# EAGLE schematic bene2stmbl-smd (EAGLE 7.2.0)
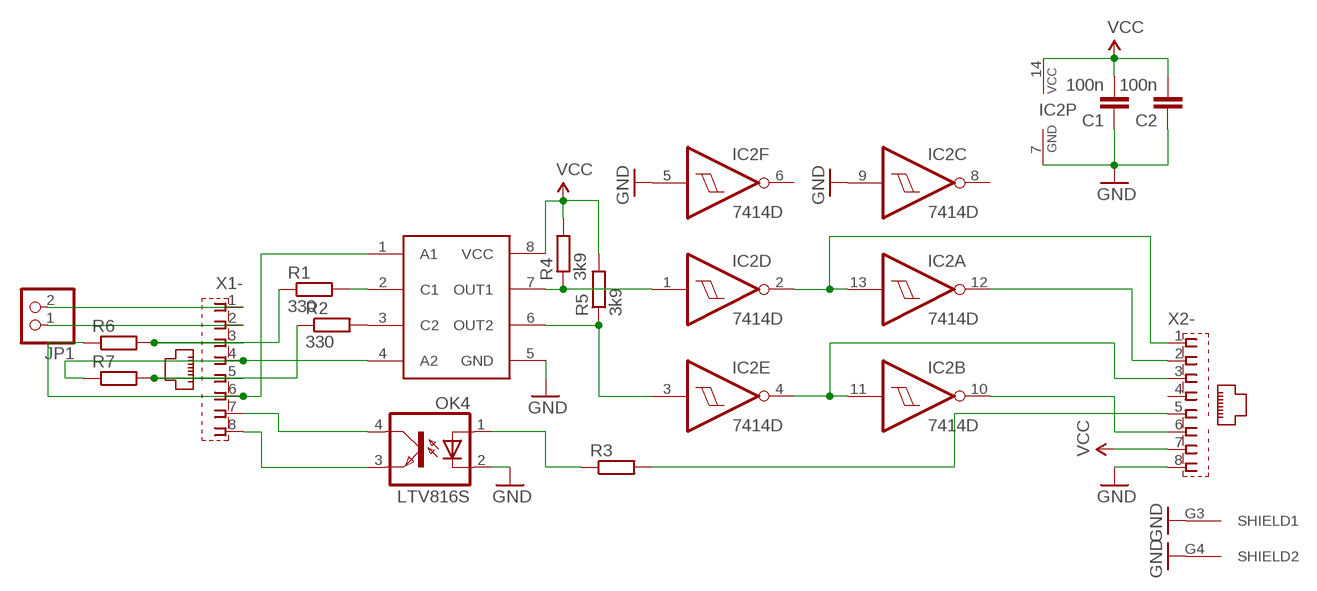
[diagram p0: schematic, sheet 1]

## Parts
C1  100n  C-EUC0603  [C0603]
C2  100n  C-EUC0603  [C0603]
IC2  7414D  [SO14]
JP1  PINHD-1X2  [1X02]
OK4  LTV816S  [SMD4]
R1  330  R-EU_R0603  [R0603]
R2  330  R-EU_R0603  [R0603]
R3  R-EU_R0603  [R0603]
R4  3k9  R-EU_R0603  [R0603]
R5  3k9  R-EU_R0603  [R0603]
R6  R-EU_R0603  [R0603]
R7  R-EU_R0603  [R0603]
U$1  HCPL-053L-SMD  [SO08]
X1  RJ45  [RJ45]
X2  RJ45  [RJ45]

## Nets
GND: C1.1 C2.1 IC2.5(F:I) IC2.7(P:GND) IC2.9(C:I) OK4.2(C) U$1.5(GND) X2.8 X2.G3(SHIELD1) X2.G4(SHIELD2)
N$1: OK4.3(EMIT) X1.8
N$2: OK4.4(COL) X1.7
N$3: IC2.2(D:O) IC2.13(A:I) X2.1
N$4: R6.1 U$1.1(A1) X1.6
N$5: IC2.4(E:O) IC2.11(B:I) X2.3
N$6: R2.1 R7.2 X1.5
N$7: R1.2 U$1.2(C1)
N$8: R2.2 U$1.3(C2)
N$9: JP1.1 X1.2
N$10: JP1.2 X1.1
N$12: IC2.1(D:I) R4.1 U$1.7(OUT1)
N$13: IC2.12(A:O) X2.2
N$14: R1.1 R6.2 X1.3
N$15: IC2.10(B:O) X2.6
N$16: OK4.1(A) R3.1
N$17: R7.1 U$1.4(A2) X1.4
N$18: R3.2 X2.5
N$20: IC2.3(E:I) R5.1 U$1.6(OUT2)
VCC: C1.2 C2.2 IC2.14(P:VCC) R4.2 R5.2 U$1.8(VCC) X2.7
Unconnected: IC2.6(F:O) IC2.8(C:O) X1.G3(SHIELD1) X1.G4(SHIELD2) X2.4

## Library data of the parts
C1 C2 = resistor:C-EU: CAPACITOR, European symbol
IC2 = 74xx-eu:74*14: Hex schmitt trigger INVERTER
JP1 = pinhead:PINHD-1X2: PIN HEADER
OK4 = optocoupler:LTV816: OPTO COUPLER Source: LITEON, LTV816.pdf; OC_FARNELL: unknown; OC_NEWARK: unknown
R1-R7 = resistor:R-EU_: RESISTOR, European symbol
U$1 = reroolib:HCPL-053L-SMD
X1 X2 = reroolib:RJ45: AMP connector